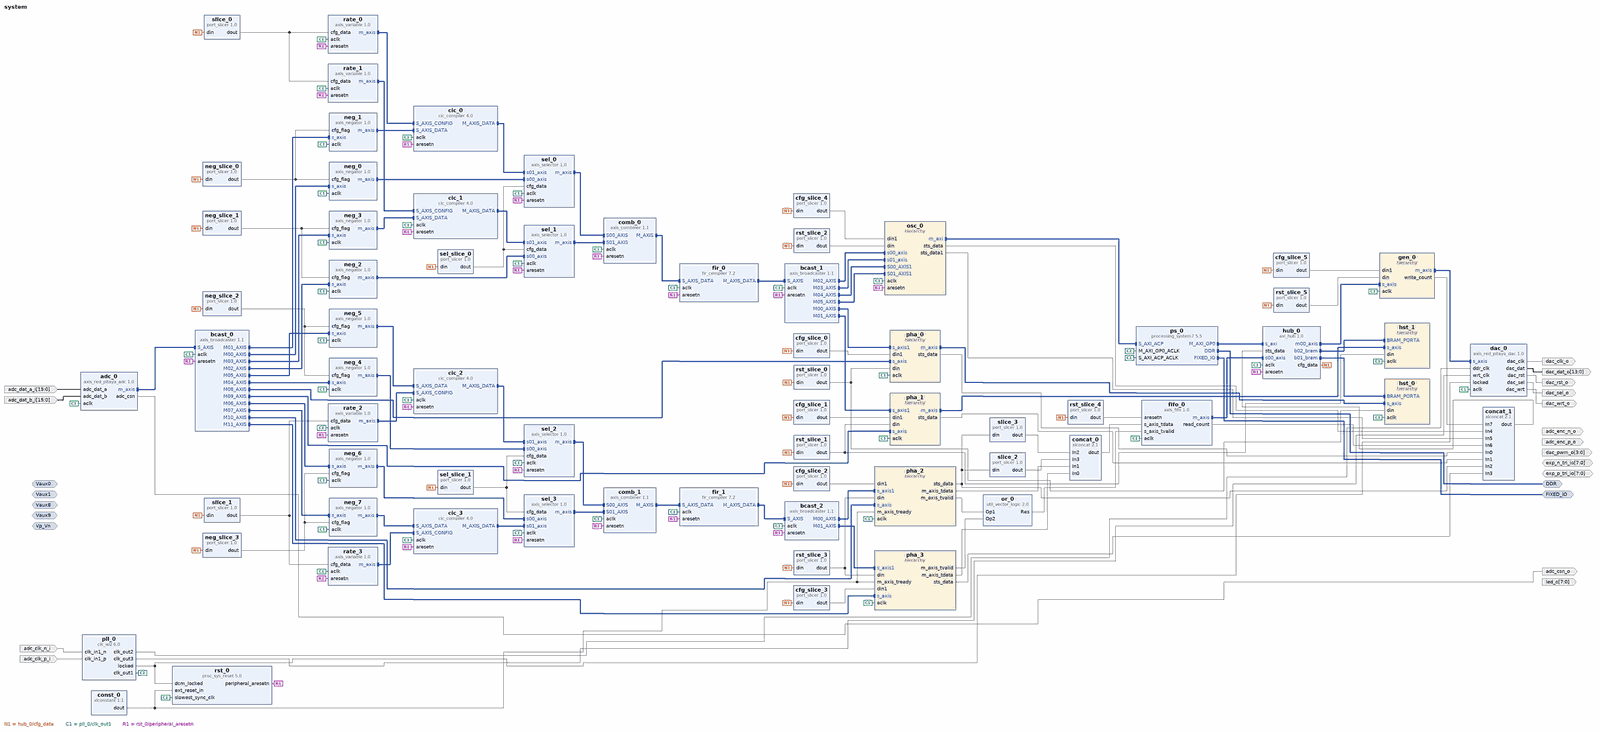
[diagram p0: block diagram of the top level, whole]
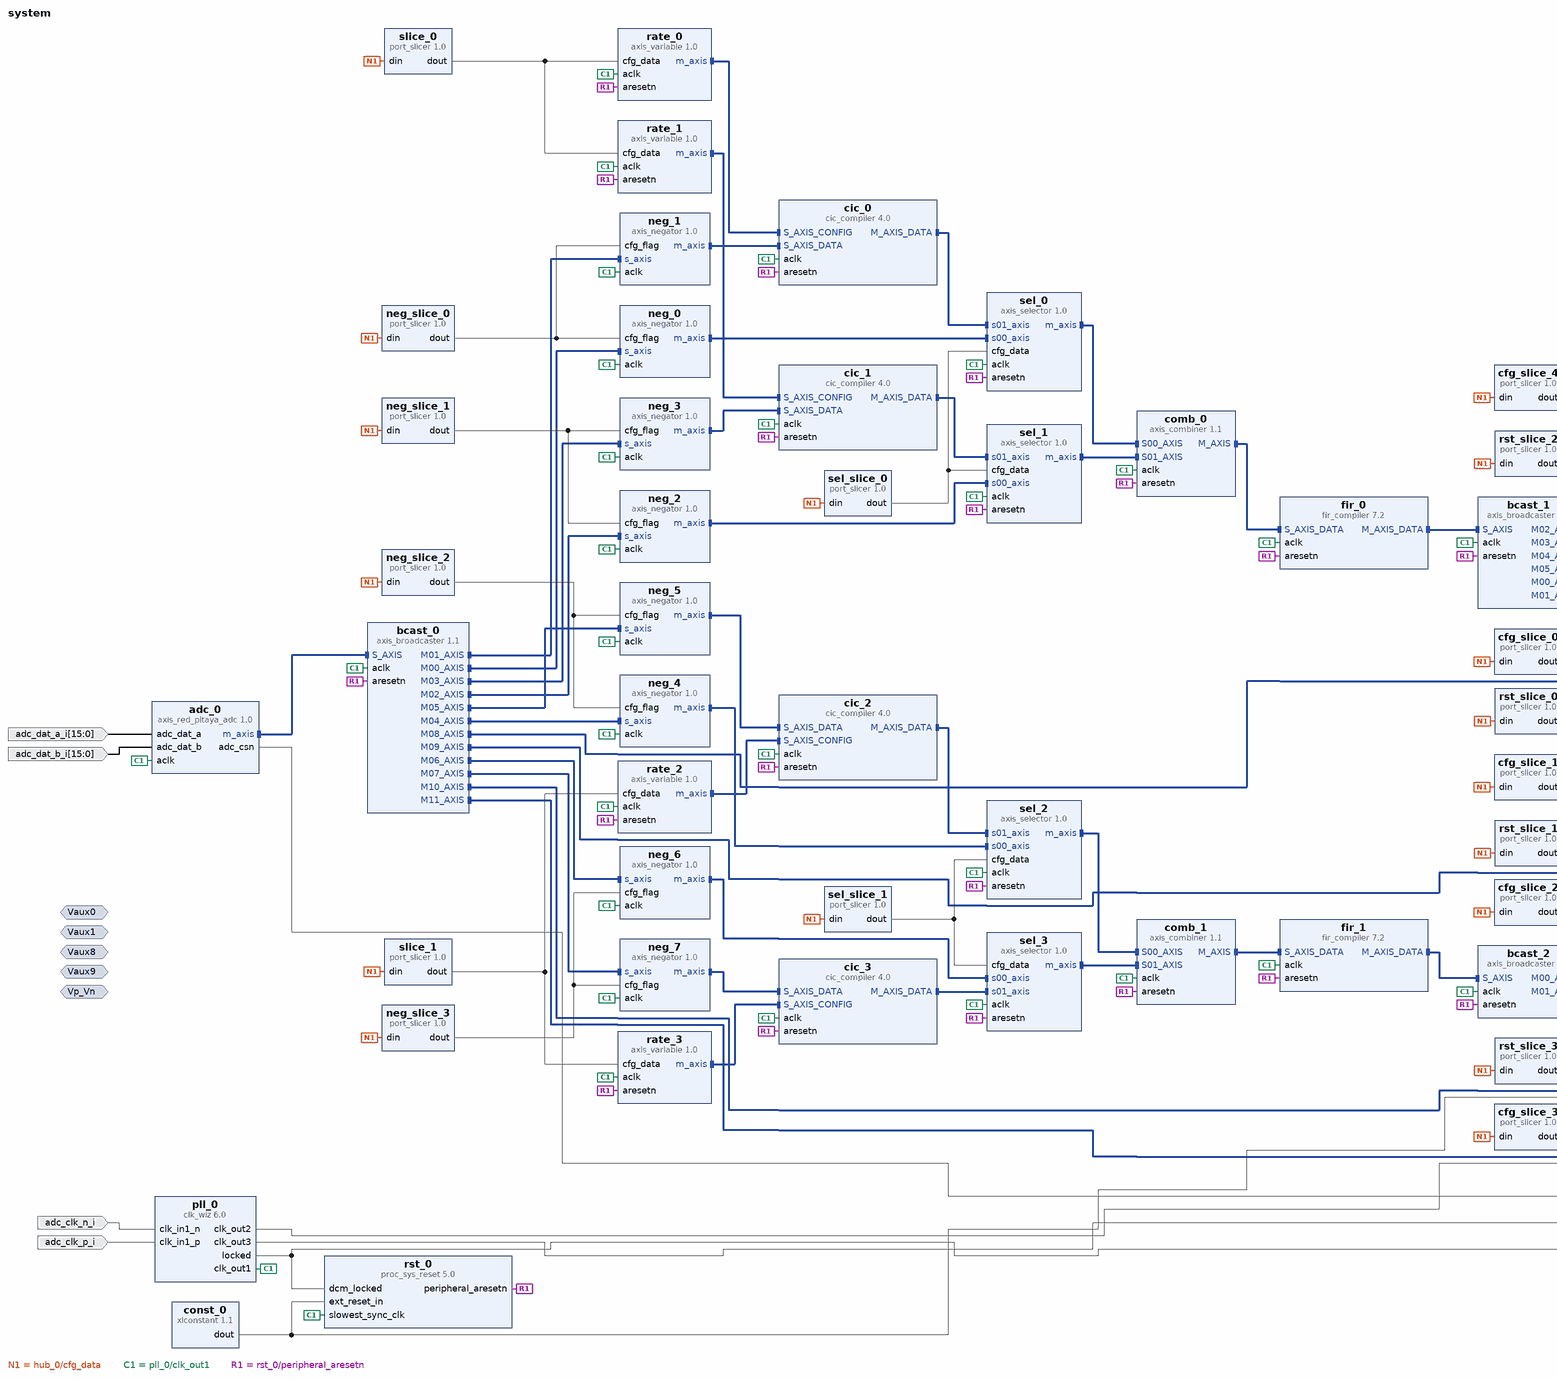
[diagram p1: block diagram of the top level, left part]
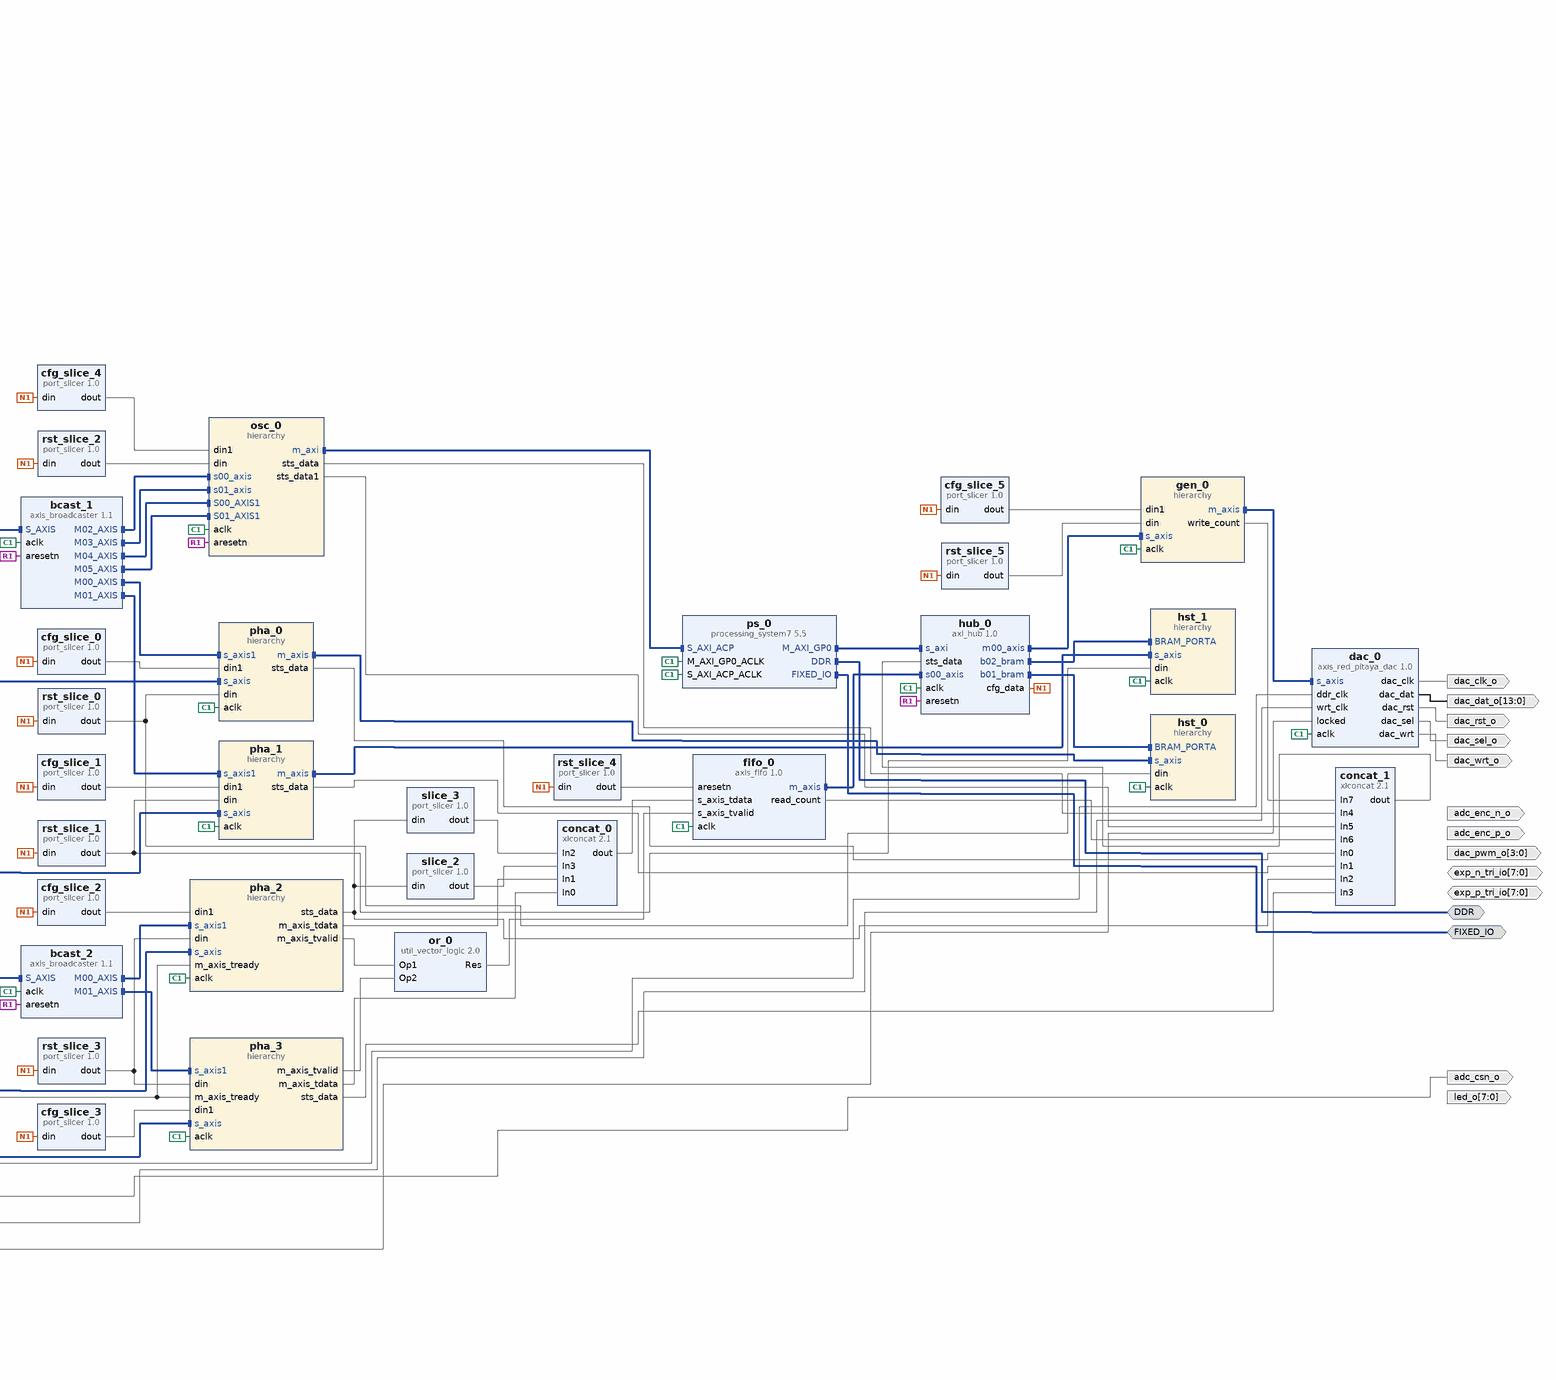
[diagram p2: block diagram of the top level, right part]
# Vivado block design system, xc7z010clg400-1, Vivado 2023.1
create_bd_design system

create_bd_intf_port -mode Slave -vlnv xilinx.com:interface:diff_analog_io_rtl:1.0 Vp_Vn
create_bd_intf_port -mode Slave -vlnv xilinx.com:interface:diff_analog_io_rtl:1.0 Vaux0
create_bd_intf_port -mode Slave -vlnv xilinx.com:interface:diff_analog_io_rtl:1.0 Vaux1
create_bd_intf_port -mode Slave -vlnv xilinx.com:interface:diff_analog_io_rtl:1.0 Vaux9
create_bd_intf_port -mode Slave -vlnv xilinx.com:interface:diff_analog_io_rtl:1.0 Vaux8
create_bd_intf_port -mode Master -vlnv xilinx.com:interface:ddrx_rtl:1.0 DDR
create_bd_intf_port -mode Master -vlnv xilinx.com:display_processing_system7:fixedio_rtl:1.0 FIXED_IO
create_bd_port -dir I -from 15 -to 0 adc_dat_a_i
create_bd_port -dir I -from 15 -to 0 adc_dat_b_i
create_bd_port -dir I adc_clk_p_i
create_bd_port -dir I adc_clk_n_i
create_bd_port -dir O adc_enc_p_o
create_bd_port -dir O adc_enc_n_o
create_bd_port -dir O adc_csn_o
create_bd_port -dir O -from 13 -to 0 dac_dat_o
create_bd_port -dir O dac_clk_o
create_bd_port -dir O dac_rst_o
create_bd_port -dir O dac_sel_o
create_bd_port -dir O dac_wrt_o
create_bd_port -dir O -from 3 -to 0 dac_pwm_o
create_bd_port -dir IO -from 7 -to 0 exp_p_tri_io
create_bd_port -dir IO -from 7 -to 0 exp_n_tri_io
create_bd_port -dir O -from 7 -to 0 led_o

create_bd_cell -type ip -vlnv xilinx.com:ip:clk_wiz:6.0 pll_0
set_property -dict [list \
  CONFIG.CLKOUT1_REQUESTED_OUT_FREQ 125.0 \
  CONFIG.CLKOUT1_USED true \
  CONFIG.CLKOUT2_REQUESTED_OUT_FREQ 250.0 \
  CONFIG.CLKOUT2_REQUESTED_PHASE 157.5 \
  CONFIG.CLKOUT2_USED true \
  CONFIG.CLKOUT3_REQUESTED_OUT_FREQ 250.0 \
  CONFIG.CLKOUT3_REQUESTED_PHASE 202.5 \
  CONFIG.CLKOUT3_USED true \
  CONFIG.PRIMITIVE PLL \
  CONFIG.PRIM_IN_FREQ 125.0 \
  CONFIG.PRIM_SOURCE Differential_clock_capable_pin \
  CONFIG.USE_RESET false \
] [get_bd_cells pll_0]
create_bd_cell -type ip -vlnv xilinx.com:ip:processing_system7:5.5 ps_0
set_property -dict [list \
  CONFIG.PCW_APU_PERIPHERAL_FREQMHZ 666.666666 \
  CONFIG.PCW_ENET0_ENET0_IO {MIO 16 .. 27} \
  CONFIG.PCW_ENET0_GRP_MDIO_ENABLE 1 \
  CONFIG.PCW_ENET0_GRP_MDIO_IO {MIO 52 .. 53} \
  CONFIG.PCW_ENET0_PERIPHERAL_ENABLE 1 \
  CONFIG.PCW_ENET0_RESET_ENABLE 0 \
  CONFIG.PCW_ENET_RESET_ENABLE 1 \
  CONFIG.PCW_ENET_RESET_SELECT {Share reset pin} \
  CONFIG.PCW_FPGA0_PERIPHERAL_FREQMHZ 50 \
  CONFIG.PCW_FPGA1_PERIPHERAL_FREQMHZ 50 \
  CONFIG.PCW_GPIO_EMIO_GPIO_ENABLE 1 \
  CONFIG.PCW_GPIO_EMIO_GPIO_IO 64 \
  CONFIG.PCW_GPIO_MIO_GPIO_ENABLE 1 \
  CONFIG.PCW_GPIO_MIO_GPIO_IO MIO \
  CONFIG.PCW_GPIO_PERIPHERAL_ENABLE 1 \
  CONFIG.PCW_I2C0_GRP_INT_ENABLE 0 \
  CONFIG.PCW_I2C0_I2C0_IO {MIO 50 .. 51} \
  CONFIG.PCW_I2C0_PERIPHERAL_ENABLE 1 \
  CONFIG.PCW_I2C_PERIPHERAL_FREQMHZ 111.111115 \
  CONFIG.PCW_I2C_RESET_ENABLE 1 \
  CONFIG.PCW_I2C_RESET_SELECT {Share reset pin} \
  CONFIG.PCW_IMPORT_BOARD_PRESET cfg/red_pitaya.xml \
  CONFIG.PCW_PRESET_BANK1_VOLTAGE {LVCMOS 2.5V} \
  CONFIG.PCW_QSPI_PERIPHERAL_ENABLE 0 \
  CONFIG.PCW_SD0_GRP_CD_ENABLE 1 \
  CONFIG.PCW_SD0_GRP_CD_IO {MIO 46} \
  CONFIG.PCW_SD0_GRP_WP_ENABLE 1 \
  CONFIG.PCW_SD0_GRP_WP_IO {MIO 47} \
  CONFIG.PCW_SD0_PERIPHERAL_ENABLE 1 \
  CONFIG.PCW_SD0_SD0_IO {MIO 40 .. 45} \
  CONFIG.PCW_SDIO_PERIPHERAL_FREQMHZ 100 \
  CONFIG.PCW_SPI0_PERIPHERAL_ENABLE 1 \
  CONFIG.PCW_SPI0_SPI0_IO EMIO \
  CONFIG.PCW_SPI1_PERIPHERAL_ENABLE 1 \
  CONFIG.PCW_SPI1_SPI1_IO {MIO 10 .. 15} \
  CONFIG.PCW_UART0_PERIPHERAL_ENABLE 1 \
  CONFIG.PCW_UART0_UART0_IO {MIO 14 .. 15} \
  CONFIG.PCW_UART1_PERIPHERAL_ENABLE 1 \
  CONFIG.PCW_UART1_UART1_IO {MIO 8 .. 9} \
  CONFIG.PCW_UART_PERIPHERAL_FREQMHZ 100 \
  CONFIG.PCW_UIPARAM_DDR_BUS_WIDTH {16 Bit} \
  CONFIG.PCW_UIPARAM_DDR_FREQ_MHZ 533.333333 \
  CONFIG.PCW_UIPARAM_DDR_PARTNO {MT41J256M16 RE-125} \
  CONFIG.PCW_USB0_PERIPHERAL_ENABLE 1 \
  CONFIG.PCW_USB0_RESET_ENABLE 1 \
  CONFIG.PCW_USB0_RESET_IO {MIO 48} \
  CONFIG.PCW_USB0_USB0_IO {MIO 28 .. 39} \
  CONFIG.PCW_USB_RESET_ENABLE 1 \
  CONFIG.PCW_USB_RESET_SELECT {Share reset pin} \
  CONFIG.PCW_USE_DEFAULT_ACP_USER_VAL 1 \
  CONFIG.PCW_USE_S_AXI_ACP 1 \
] [get_bd_cells ps_0]
# 429 more settings of ps_0 are not shown: defaults, MIO pin electricals, DDR timing, and values the tool derives
create_bd_cell -type ip -vlnv xilinx.com:ip:xlconstant:1.1 const_0
create_bd_cell -type ip -vlnv xilinx.com:ip:proc_sys_reset:5.0 rst_0
create_bd_cell -type ip -vlnv pavel-demin:user:axis_red_pitaya_adc:1.0 adc_0
set_property -dict {CONFIG.ADC_DATA_WIDTH 14} [get_bd_cells adc_0]
create_bd_cell -type ip -vlnv pavel-demin:user:axis_red_pitaya_dac:1.0 dac_0
set_property -dict {CONFIG.DAC_DATA_WIDTH 14} [get_bd_cells dac_0]
create_bd_cell -type ip -vlnv pavel-demin:user:axi_hub:1.0 hub_0
set_property -dict {CONFIG.CFG_DATA_WIDTH 800 CONFIG.STS_DATA_WIDTH 352} [get_bd_cells hub_0]
create_bd_cell -type ip -vlnv pavel-demin:user:port_slicer:1.0 rst_slice_0
set_property -dict {CONFIG.DIN_FROM 7 CONFIG.DIN_TO 0 CONFIG.DIN_WIDTH 800} [get_bd_cells rst_slice_0]
create_bd_cell -type ip -vlnv pavel-demin:user:port_slicer:1.0 sel_slice_0
set_property -dict {CONFIG.DIN_FROM 3 CONFIG.DIN_TO 3 CONFIG.DIN_WIDTH 800} [get_bd_cells sel_slice_0]
create_bd_cell -type ip -vlnv pavel-demin:user:port_slicer:1.0 neg_slice_0
set_property -dict {CONFIG.DIN_FROM 4 CONFIG.DIN_TO 4 CONFIG.DIN_WIDTH 800} [get_bd_cells neg_slice_0]
create_bd_cell -type ip -vlnv pavel-demin:user:port_slicer:1.0 rst_slice_1
set_property -dict {CONFIG.DIN_FROM 15 CONFIG.DIN_TO 8 CONFIG.DIN_WIDTH 800} [get_bd_cells rst_slice_1]
create_bd_cell -type ip -vlnv pavel-demin:user:port_slicer:1.0 neg_slice_1
set_property -dict {CONFIG.DIN_FROM 12 CONFIG.DIN_TO 12 CONFIG.DIN_WIDTH 800} [get_bd_cells neg_slice_1]
create_bd_cell -type ip -vlnv pavel-demin:user:port_slicer:1.0 rst_slice_2
set_property -dict {CONFIG.DIN_FROM 23 CONFIG.DIN_TO 16 CONFIG.DIN_WIDTH 800} [get_bd_cells rst_slice_2]
create_bd_cell -type ip -vlnv pavel-demin:user:port_slicer:1.0 rst_slice_3
set_property -dict {CONFIG.DIN_FROM 31 CONFIG.DIN_TO 24 CONFIG.DIN_WIDTH 800} [get_bd_cells rst_slice_3]
create_bd_cell -type ip -vlnv pavel-demin:user:port_slicer:1.0 sel_slice_1
set_property -dict {CONFIG.DIN_FROM 27 CONFIG.DIN_TO 27 CONFIG.DIN_WIDTH 800} [get_bd_cells sel_slice_1]
create_bd_cell -type ip -vlnv pavel-demin:user:port_slicer:1.0 neg_slice_2
set_property -dict {CONFIG.DIN_FROM 28 CONFIG.DIN_TO 28 CONFIG.DIN_WIDTH 800} [get_bd_cells neg_slice_2]
create_bd_cell -type ip -vlnv pavel-demin:user:port_slicer:1.0 neg_slice_3
set_property -dict {CONFIG.DIN_FROM 29 CONFIG.DIN_TO 29 CONFIG.DIN_WIDTH 800} [get_bd_cells neg_slice_3]
create_bd_cell -type ip -vlnv pavel-demin:user:port_slicer:1.0 rst_slice_4
set_property -dict {CONFIG.DIN_FROM 30 CONFIG.DIN_TO 30 CONFIG.DIN_WIDTH 800} [get_bd_cells rst_slice_4]
create_bd_cell -type ip -vlnv pavel-demin:user:port_slicer:1.0 rst_slice_5
set_property -dict {CONFIG.DIN_FROM 31 CONFIG.DIN_TO 31 CONFIG.DIN_WIDTH 800} [get_bd_cells rst_slice_5]
create_bd_cell -type ip -vlnv pavel-demin:user:port_slicer:1.0 slice_0
set_property -dict {CONFIG.DIN_FROM 47 CONFIG.DIN_TO 32 CONFIG.DIN_WIDTH 800} [get_bd_cells slice_0]
create_bd_cell -type ip -vlnv pavel-demin:user:port_slicer:1.0 slice_1
set_property -dict {CONFIG.DIN_FROM 63 CONFIG.DIN_TO 48 CONFIG.DIN_WIDTH 800} [get_bd_cells slice_1]
create_bd_cell -type ip -vlnv pavel-demin:user:port_slicer:1.0 cfg_slice_0
set_property -dict {CONFIG.DIN_FROM 191 CONFIG.DIN_TO 64 CONFIG.DIN_WIDTH 800} [get_bd_cells cfg_slice_0]
create_bd_cell -type ip -vlnv pavel-demin:user:port_slicer:1.0 cfg_slice_1
set_property -dict {CONFIG.DIN_FROM 319 CONFIG.DIN_TO 192 CONFIG.DIN_WIDTH 800} [get_bd_cells cfg_slice_1]
create_bd_cell -type ip -vlnv pavel-demin:user:port_slicer:1.0 cfg_slice_2
set_property -dict {CONFIG.DIN_FROM 447 CONFIG.DIN_TO 320 CONFIG.DIN_WIDTH 800} [get_bd_cells cfg_slice_2]
create_bd_cell -type ip -vlnv pavel-demin:user:port_slicer:1.0 cfg_slice_3
set_property -dict {CONFIG.DIN_FROM 575 CONFIG.DIN_TO 448 CONFIG.DIN_WIDTH 800} [get_bd_cells cfg_slice_3]
create_bd_cell -type ip -vlnv pavel-demin:user:port_slicer:1.0 cfg_slice_4
set_property -dict {CONFIG.DIN_FROM 703 CONFIG.DIN_TO 576 CONFIG.DIN_WIDTH 800} [get_bd_cells cfg_slice_4]
create_bd_cell -type ip -vlnv pavel-demin:user:port_slicer:1.0 cfg_slice_5
set_property -dict {CONFIG.DIN_FROM 799 CONFIG.DIN_TO 704 CONFIG.DIN_WIDTH 800} [get_bd_cells cfg_slice_5]
create_bd_cell -type ip -vlnv xilinx.com:ip:axis_broadcaster:1.1 bcast_0
set_property -dict [list \
  CONFIG.M00_TDATA_REMAP {tdata[15:0]} \
  CONFIG.M01_TDATA_REMAP {tdata[15:0]} \
  CONFIG.M02_TDATA_REMAP {tdata[31:16]} \
  CONFIG.M03_TDATA_REMAP {tdata[31:16]} \
  CONFIG.M04_TDATA_REMAP {tdata[15:0]} \
  CONFIG.M05_TDATA_REMAP {tdata[15:0]} \
  CONFIG.M06_TDATA_REMAP {tdata[31:16]} \
  CONFIG.M07_TDATA_REMAP {tdata[31:16]} \
  CONFIG.M08_TDATA_REMAP {16'b0000000000000000} \
  CONFIG.M09_TDATA_REMAP {16'b0000000000000000} \
  CONFIG.M10_TDATA_REMAP {16'b0000000000000000} \
  CONFIG.M11_TDATA_REMAP {16'b0000000000000000} \
  CONFIG.M_TDATA_NUM_BYTES 2 \
  CONFIG.NUM_MI 12 \
  CONFIG.S_TDATA_NUM_BYTES 4 \
] [get_bd_cells bcast_0]
create_bd_cell -type ip -vlnv pavel-demin:user:axis_negator:1.0 neg_0
set_property -dict {CONFIG.AXIS_TDATA_WIDTH 16} [get_bd_cells neg_0]
create_bd_cell -type ip -vlnv pavel-demin:user:axis_negator:1.0 neg_1
set_property -dict {CONFIG.AXIS_TDATA_WIDTH 16} [get_bd_cells neg_1]
create_bd_cell -type ip -vlnv pavel-demin:user:axis_negator:1.0 neg_2
set_property -dict {CONFIG.AXIS_TDATA_WIDTH 16} [get_bd_cells neg_2]
create_bd_cell -type ip -vlnv pavel-demin:user:axis_negator:1.0 neg_3
set_property -dict {CONFIG.AXIS_TDATA_WIDTH 16} [get_bd_cells neg_3]
create_bd_cell -type ip -vlnv pavel-demin:user:axis_negator:1.0 neg_4
set_property -dict {CONFIG.AXIS_TDATA_WIDTH 16} [get_bd_cells neg_4]
create_bd_cell -type ip -vlnv pavel-demin:user:axis_negator:1.0 neg_5
set_property -dict {CONFIG.AXIS_TDATA_WIDTH 16} [get_bd_cells neg_5]
create_bd_cell -type ip -vlnv pavel-demin:user:axis_negator:1.0 neg_6
set_property -dict {CONFIG.AXIS_TDATA_WIDTH 16} [get_bd_cells neg_6]
create_bd_cell -type ip -vlnv pavel-demin:user:axis_negator:1.0 neg_7
set_property -dict {CONFIG.AXIS_TDATA_WIDTH 16} [get_bd_cells neg_7]
create_bd_cell -type ip -vlnv pavel-demin:user:axis_variable:1.0 rate_0
set_property -dict {CONFIG.AXIS_TDATA_WIDTH 16} [get_bd_cells rate_0]
create_bd_cell -type ip -vlnv xilinx.com:ip:cic_compiler:4.0 cic_0
set_property -dict [list \
  CONFIG.Clock_Frequency 125 \
  CONFIG.Filter_Type Decimation \
  CONFIG.Fixed_Or_Initial_Rate 4 \
  CONFIG.HAS_ARESETN true \
  CONFIG.Input_Data_Width 14 \
  CONFIG.Input_Sample_Frequency 125 \
  CONFIG.Maximum_Rate 8192 \
  CONFIG.Minimum_Rate 4 \
  CONFIG.Number_Of_Stages 6 \
  CONFIG.Output_Data_Width 14 \
  CONFIG.Quantization Truncation \
  CONFIG.Sample_Rate_Changes Programmable \
  CONFIG.Use_Xtreme_DSP_Slice false \
] [get_bd_cells cic_0]
create_bd_cell -type ip -vlnv pavel-demin:user:axis_selector:1.0 sel_0
set_property -dict {CONFIG.AXIS_TDATA_WIDTH 16} [get_bd_cells sel_0]
create_bd_cell -type ip -vlnv pavel-demin:user:axis_variable:1.0 rate_1
set_property -dict {CONFIG.AXIS_TDATA_WIDTH 16} [get_bd_cells rate_1]
create_bd_cell -type ip -vlnv xilinx.com:ip:cic_compiler:4.0 cic_1
set_property -dict [list \
  CONFIG.Clock_Frequency 125 \
  CONFIG.Filter_Type Decimation \
  CONFIG.Fixed_Or_Initial_Rate 4 \
  CONFIG.HAS_ARESETN true \
  CONFIG.Input_Data_Width 14 \
  CONFIG.Input_Sample_Frequency 125 \
  CONFIG.Maximum_Rate 8192 \
  CONFIG.Minimum_Rate 4 \
  CONFIG.Number_Of_Stages 6 \
  CONFIG.Output_Data_Width 14 \
  CONFIG.Quantization Truncation \
  CONFIG.Sample_Rate_Changes Programmable \
  CONFIG.Use_Xtreme_DSP_Slice false \
] [get_bd_cells cic_1]
create_bd_cell -type ip -vlnv pavel-demin:user:axis_selector:1.0 sel_1
set_property -dict {CONFIG.AXIS_TDATA_WIDTH 16} [get_bd_cells sel_1]
create_bd_cell -type ip -vlnv pavel-demin:user:axis_variable:1.0 rate_2
set_property -dict {CONFIG.AXIS_TDATA_WIDTH 16} [get_bd_cells rate_2]
create_bd_cell -type ip -vlnv xilinx.com:ip:cic_compiler:4.0 cic_2
set_property -dict [list \
  CONFIG.Clock_Frequency 125 \
  CONFIG.Filter_Type Decimation \
  CONFIG.Fixed_Or_Initial_Rate 4 \
  CONFIG.HAS_ARESETN true \
  CONFIG.Input_Data_Width 14 \
  CONFIG.Input_Sample_Frequency 125 \
  CONFIG.Maximum_Rate 8192 \
  CONFIG.Minimum_Rate 4 \
  CONFIG.Number_Of_Stages 6 \
  CONFIG.Output_Data_Width 14 \
  CONFIG.Quantization Truncation \
  CONFIG.Sample_Rate_Changes Programmable \
  CONFIG.Use_Xtreme_DSP_Slice false \
] [get_bd_cells cic_2]
create_bd_cell -type ip -vlnv pavel-demin:user:axis_selector:1.0 sel_2
set_property -dict {CONFIG.AXIS_TDATA_WIDTH 16} [get_bd_cells sel_2]
create_bd_cell -type ip -vlnv pavel-demin:user:axis_variable:1.0 rate_3
set_property -dict {CONFIG.AXIS_TDATA_WIDTH 16} [get_bd_cells rate_3]
create_bd_cell -type ip -vlnv xilinx.com:ip:cic_compiler:4.0 cic_3
set_property -dict [list \
  CONFIG.Clock_Frequency 125 \
  CONFIG.Filter_Type Decimation \
  CONFIG.Fixed_Or_Initial_Rate 4 \
  CONFIG.HAS_ARESETN true \
  CONFIG.Input_Data_Width 14 \
  CONFIG.Input_Sample_Frequency 125 \
  CONFIG.Maximum_Rate 8192 \
  CONFIG.Minimum_Rate 4 \
  CONFIG.Number_Of_Stages 6 \
  CONFIG.Output_Data_Width 14 \
  CONFIG.Quantization Truncation \
  CONFIG.Sample_Rate_Changes Programmable \
  CONFIG.Use_Xtreme_DSP_Slice false \
] [get_bd_cells cic_3]
create_bd_cell -type ip -vlnv pavel-demin:user:axis_selector:1.0 sel_3
set_property -dict {CONFIG.AXIS_TDATA_WIDTH 16} [get_bd_cells sel_3]
create_bd_cell -type ip -vlnv xilinx.com:ip:axis_combiner:1.1 comb_0
set_property -dict {CONFIG.TDATA_NUM_BYTES 2} [get_bd_cells comb_0]
create_bd_cell -type ip -vlnv xilinx.com:ip:fir_compiler:7.2 fir_0
set_property -dict [list \
  CONFIG.BestPrecision true \
  CONFIG.Clock_Frequency 125 \
  CONFIG.CoefficientVector {['5.2264535203e-06, 5.7185303335e-05, 2.6647653637e-04, 7.9231931667e-04, 1.8933556984e-03, 3.9077032410e-03, 7.2107962593e-03, 1.2147384825e-02, 1.8943280784e-02, 2.7612738319e-02, 3.7884778843e-02,', '4.9172940009e-02, 6.0606317648e-02, 7.1126384126e-02, 7.9637295055e-02, 8.5182038247e-02, 8.7107558671e-02, 8.5182038247e-02, 7.9637295055e-02, 7.1126384126e-02, 6.0606317648e-02, 4.9172940009e-02,', '3.7884778843e-02, 2.7612738319e-02, 1.8943280784e-02, 1.2147384825e-02, 7.2107962593e-03, 3.9077032410e-03, 1.8933556984e-03, 7.9231931667e-04, 2.6647653637e-04, 5.7185303335e-05, 5.2264535203e-06']} \
  CONFIG.Coefficient_Width 16 \
  CONFIG.Data_Width 14 \
  CONFIG.Has_ARESETn true \
  CONFIG.Number_Paths 2 \
  CONFIG.Output_Rounding_Mode Non_Symmetric_Rounding_Up \
  CONFIG.Output_Width 14 \
  CONFIG.Quantization Quantize_Only \
  CONFIG.Sample_Frequency 125 \
] [get_bd_cells fir_0]
create_bd_cell -type ip -vlnv xilinx.com:ip:axis_combiner:1.1 comb_1
set_property -dict {CONFIG.TDATA_NUM_BYTES 2} [get_bd_cells comb_1]
create_bd_cell -type ip -vlnv xilinx.com:ip:fir_compiler:7.2 fir_1
set_property -dict [list \
  CONFIG.BestPrecision true \
  CONFIG.Clock_Frequency 125 \
  CONFIG.CoefficientVector {['5.2264535203e-06, 5.7185303335e-05, 2.6647653637e-04, 7.9231931667e-04, 1.8933556984e-03, 3.9077032410e-03, 7.2107962593e-03, 1.2147384825e-02, 1.8943280784e-02, 2.7612738319e-02, 3.7884778843e-02,', '4.9172940009e-02, 6.0606317648e-02, 7.1126384126e-02, 7.9637295055e-02, 8.5182038247e-02, 8.7107558671e-02, 8.5182038247e-02, 7.9637295055e-02, 7.1126384126e-02, 6.0606317648e-02, 4.9172940009e-02,', '3.7884778843e-02, 2.7612738319e-02, 1.8943280784e-02, 1.2147384825e-02, 7.2107962593e-03, 3.9077032410e-03, 1.8933556984e-03, 7.9231931667e-04, 2.6647653637e-04, 5.7185303335e-05, 5.2264535203e-06']} \
  CONFIG.Coefficient_Width 16 \
  CONFIG.Data_Width 14 \
  CONFIG.Has_ARESETn true \
  CONFIG.Number_Paths 2 \
  CONFIG.Output_Rounding_Mode Non_Symmetric_Rounding_Up \
  CONFIG.Output_Width 14 \
  CONFIG.Quantization Quantize_Only \
  CONFIG.Sample_Frequency 125 \
] [get_bd_cells fir_1]
create_bd_cell -type ip -vlnv xilinx.com:ip:axis_broadcaster:1.1 bcast_1
set_property -dict [list \
  CONFIG.M00_TDATA_REMAP {tdata[15:0]} \
  CONFIG.M01_TDATA_REMAP {tdata[31:16]} \
  CONFIG.M02_TDATA_REMAP {tdata[15:0]} \
  CONFIG.M03_TDATA_REMAP {tdata[31:16]} \
  CONFIG.M04_TDATA_REMAP {tdata[15:0]} \
  CONFIG.M05_TDATA_REMAP {tdata[31:16]} \
  CONFIG.M_TDATA_NUM_BYTES 2 \
  CONFIG.NUM_MI 6 \
  CONFIG.S_TDATA_NUM_BYTES 4 \
] [get_bd_cells bcast_1]
create_bd_cell -type ip -vlnv xilinx.com:ip:axis_broadcaster:1.1 bcast_2
set_property -dict [list \
  CONFIG.M00_TDATA_REMAP {tdata[15:0]} \
  CONFIG.M01_TDATA_REMAP {tdata[31:16]} \
  CONFIG.M_TDATA_NUM_BYTES 2 \
  CONFIG.S_TDATA_NUM_BYTES 4 \
] [get_bd_cells bcast_2]
create_bd_cell -type hier pha_0
create_bd_cell -type hier hst_0
create_bd_cell -type hier pha_1
create_bd_cell -type hier hst_1
create_bd_cell -type hier osc_0
create_bd_cell -type hier pha_2
create_bd_cell -type hier pha_3
create_bd_cell -type ip -vlnv pavel-demin:user:port_slicer:1.0 slice_2
set_property -dict {CONFIG.DIN_FROM 31 CONFIG.DIN_TO 0 CONFIG.DIN_WIDTH 64} [get_bd_cells slice_2]
create_bd_cell -type ip -vlnv pavel-demin:user:port_slicer:1.0 slice_3
set_property -dict {CONFIG.DIN_FROM 63 CONFIG.DIN_TO 32 CONFIG.DIN_WIDTH 64} [get_bd_cells slice_3]
create_bd_cell -type ip -vlnv xilinx.com:ip:xlconcat:2.1 concat_0
set_property -dict [list \
  CONFIG.IN0_WIDTH 32 \
  CONFIG.IN1_WIDTH 32 \
  CONFIG.IN2_WIDTH 32 \
  CONFIG.IN3_WIDTH 32 \
  CONFIG.NUM_PORTS 4 \
] [get_bd_cells concat_0]
create_bd_cell -type ip -vlnv xilinx.com:ip:util_vector_logic:2.0 or_0
set_property -dict {CONFIG.C_OPERATION or CONFIG.C_SIZE 1} [get_bd_cells or_0]
create_bd_cell -type ip -vlnv pavel-demin:user:axis_fifo:1.0 fifo_0
set_property -dict {CONFIG.M_AXIS_TDATA_WIDTH 32 CONFIG.S_AXIS_TDATA_WIDTH 128 CONFIG.WRITE_DEPTH 2048} [get_bd_cells fifo_0]
create_bd_cell -type hier gen_0
create_bd_cell -type ip -vlnv xilinx.com:ip:xlconcat:2.1 concat_1
set_property -dict [list \
  CONFIG.IN0_WIDTH 64 \
  CONFIG.IN1_WIDTH 64 \
  CONFIG.IN2_WIDTH 64 \
  CONFIG.IN3_WIDTH 64 \
  CONFIG.IN4_WIDTH 32 \
  CONFIG.IN5_WIDTH 32 \
  CONFIG.IN6_WIDTH 16 \
  CONFIG.IN7_WIDTH 16 \
  CONFIG.NUM_PORTS 8 \
] [get_bd_cells concat_1]

# ---- hierarchy /pha_0 ----
current_bd_instance /pha_0
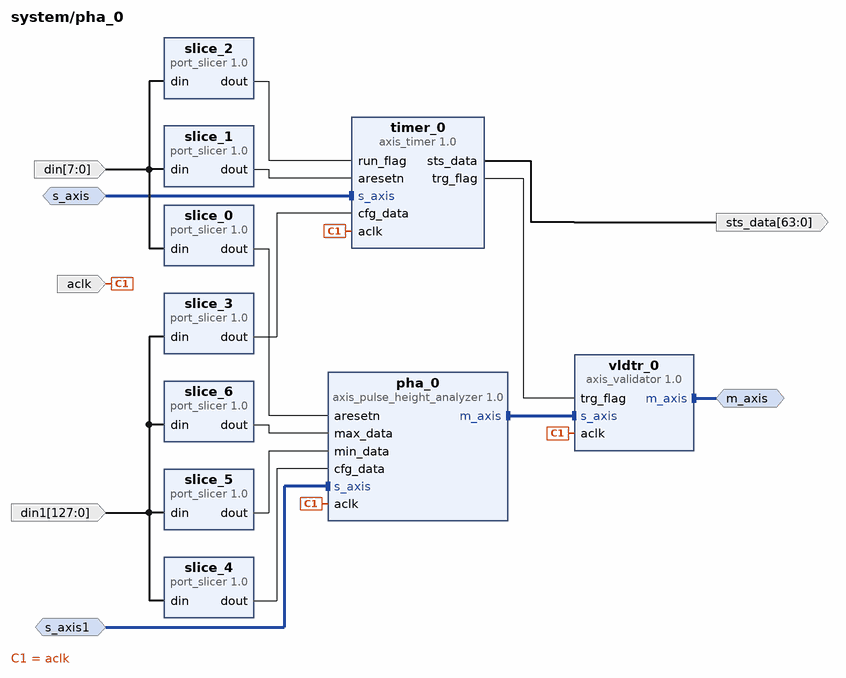
[diagram p3: block diagram inside /pha_0]
create_bd_intf_pin -mode Slave -vlnv xilinx.com:interface:axis_rtl:1.0 s_axis
create_bd_intf_pin -mode Slave -vlnv xilinx.com:interface:axis_rtl:1.0 s_axis1
create_bd_intf_pin -mode Master -vlnv xilinx.com:interface:axis_rtl:1.0 m_axis
create_bd_pin -dir I -type clk aclk
create_bd_pin -dir I -from 7 -to 0 din
create_bd_pin -dir I -from 127 -to 0 din1
create_bd_pin -dir O -from 63 -to 0 sts_data

create_bd_cell -type ip -vlnv pavel-demin:user:port_slicer:1.0 slice_0
set_property -dict {CONFIG.DIN_FROM 0 CONFIG.DIN_TO 0 CONFIG.DIN_WIDTH 8} [get_bd_cells slice_0]
create_bd_cell -type ip -vlnv pavel-demin:user:port_slicer:1.0 slice_1
set_property -dict {CONFIG.DIN_FROM 1 CONFIG.DIN_TO 1 CONFIG.DIN_WIDTH 8} [get_bd_cells slice_1]
create_bd_cell -type ip -vlnv pavel-demin:user:port_slicer:1.0 slice_2
set_property -dict {CONFIG.DIN_FROM 2 CONFIG.DIN_TO 2 CONFIG.DIN_WIDTH 8} [get_bd_cells slice_2]
create_bd_cell -type ip -vlnv pavel-demin:user:port_slicer:1.0 slice_3
set_property -dict {CONFIG.DIN_FROM 63 CONFIG.DIN_TO 0 CONFIG.DIN_WIDTH 128} [get_bd_cells slice_3]
create_bd_cell -type ip -vlnv pavel-demin:user:port_slicer:1.0 slice_4
set_property -dict {CONFIG.DIN_FROM 79 CONFIG.DIN_TO 64 CONFIG.DIN_WIDTH 128} [get_bd_cells slice_4]
create_bd_cell -type ip -vlnv pavel-demin:user:port_slicer:1.0 slice_5
set_property -dict {CONFIG.DIN_FROM 95 CONFIG.DIN_TO 80 CONFIG.DIN_WIDTH 128} [get_bd_cells slice_5]
create_bd_cell -type ip -vlnv pavel-demin:user:port_slicer:1.0 slice_6
set_property -dict {CONFIG.DIN_FROM 111 CONFIG.DIN_TO 96 CONFIG.DIN_WIDTH 128} [get_bd_cells slice_6]
create_bd_cell -type ip -vlnv pavel-demin:user:axis_timer:1.0 timer_0
set_property -dict {CONFIG.CNTR_WIDTH 64} [get_bd_cells timer_0]
create_bd_cell -type ip -vlnv pavel-demin:user:axis_pulse_height_analyzer:1.0 pha_0
set_property -dict {CONFIG.AXIS_TDATA_SIGNED TRUE CONFIG.AXIS_TDATA_WIDTH 16 CONFIG.CNTR_WIDTH 16} [get_bd_cells pha_0]
create_bd_cell -type ip -vlnv pavel-demin:user:axis_validator:1.0 vldtr_0
set_property -dict {CONFIG.AXIS_TDATA_WIDTH 16} [get_bd_cells vldtr_0]

# ---- hierarchy /hst_0 ----
current_bd_instance /hst_0
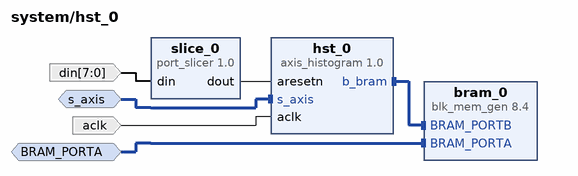
[diagram p4: block diagram inside /hst_0]
create_bd_intf_pin -mode Slave -vlnv xilinx.com:interface:axis_rtl:1.0 s_axis
create_bd_intf_pin -mode Slave -vlnv xilinx.com:interface:bram_rtl:1.0 BRAM_PORTA
create_bd_pin -dir I -type clk aclk
create_bd_pin -dir I -from 7 -to 0 din

create_bd_cell -type ip -vlnv pavel-demin:user:port_slicer:1.0 slice_0
set_property -dict {CONFIG.DIN_FROM 0 CONFIG.DIN_TO 0 CONFIG.DIN_WIDTH 8} [get_bd_cells slice_0]
create_bd_cell -type ip -vlnv xilinx.com:ip:blk_mem_gen:8.4 bram_0
set_property -dict [list \
  CONFIG.Byte_Size 8 \
  CONFIG.Memory_Type True_Dual_Port_RAM \
  CONFIG.Register_PortA_Output_of_Memory_Primitives false \
  CONFIG.Register_PortB_Output_of_Memory_Primitives false \
  CONFIG.Use_Byte_Write_Enable true \
  CONFIG.Write_Depth_A 4096 \
  CONFIG.Write_Width_A 32 \
  CONFIG.use_bram_block Stand_Alone \
] [get_bd_cells bram_0]
create_bd_cell -type ip -vlnv pavel-demin:user:axis_histogram:1.0 hst_0
set_property -dict {CONFIG.AXIS_TDATA_WIDTH 16 CONFIG.BRAM_ADDR_WIDTH 12 CONFIG.BRAM_DATA_WIDTH 32} [get_bd_cells hst_0]

# ---- hierarchy /pha_1 ----
current_bd_instance /pha_1
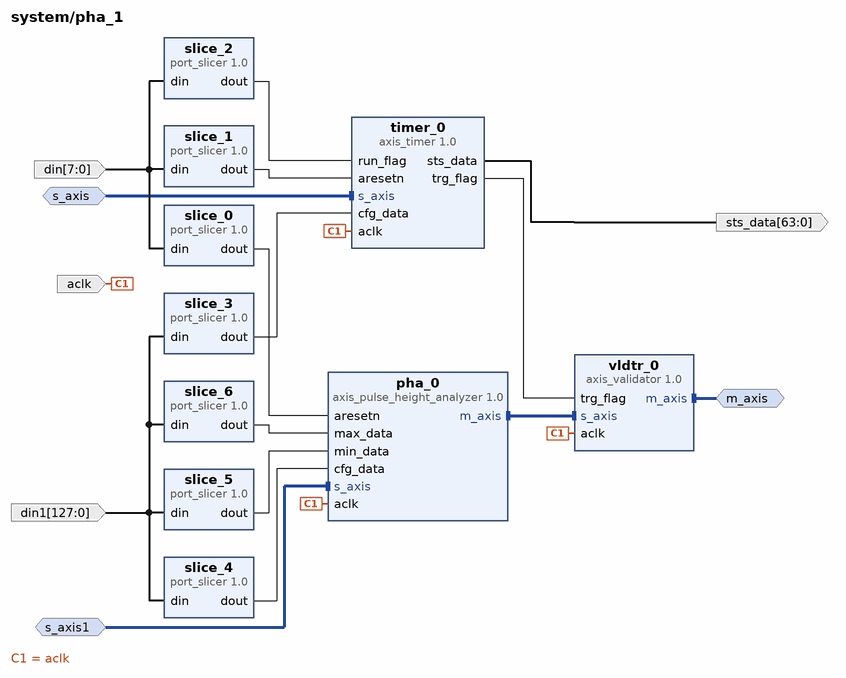
[diagram p5: block diagram inside /pha_1]
create_bd_intf_pin -mode Slave -vlnv xilinx.com:interface:axis_rtl:1.0 s_axis
create_bd_intf_pin -mode Slave -vlnv xilinx.com:interface:axis_rtl:1.0 s_axis1
create_bd_intf_pin -mode Master -vlnv xilinx.com:interface:axis_rtl:1.0 m_axis
create_bd_pin -dir I -type clk aclk
create_bd_pin -dir I -from 7 -to 0 din
create_bd_pin -dir I -from 127 -to 0 din1
create_bd_pin -dir O -from 63 -to 0 sts_data

create_bd_cell -type ip -vlnv pavel-demin:user:port_slicer:1.0 slice_0
set_property -dict {CONFIG.DIN_FROM 0 CONFIG.DIN_TO 0 CONFIG.DIN_WIDTH 8} [get_bd_cells slice_0]
create_bd_cell -type ip -vlnv pavel-demin:user:port_slicer:1.0 slice_1
set_property -dict {CONFIG.DIN_FROM 1 CONFIG.DIN_TO 1 CONFIG.DIN_WIDTH 8} [get_bd_cells slice_1]
create_bd_cell -type ip -vlnv pavel-demin:user:port_slicer:1.0 slice_2
set_property -dict {CONFIG.DIN_FROM 2 CONFIG.DIN_TO 2 CONFIG.DIN_WIDTH 8} [get_bd_cells slice_2]
create_bd_cell -type ip -vlnv pavel-demin:user:port_slicer:1.0 slice_3
set_property -dict {CONFIG.DIN_FROM 63 CONFIG.DIN_TO 0 CONFIG.DIN_WIDTH 128} [get_bd_cells slice_3]
create_bd_cell -type ip -vlnv pavel-demin:user:port_slicer:1.0 slice_4
set_property -dict {CONFIG.DIN_FROM 79 CONFIG.DIN_TO 64 CONFIG.DIN_WIDTH 128} [get_bd_cells slice_4]
create_bd_cell -type ip -vlnv pavel-demin:user:port_slicer:1.0 slice_5
set_property -dict {CONFIG.DIN_FROM 95 CONFIG.DIN_TO 80 CONFIG.DIN_WIDTH 128} [get_bd_cells slice_5]
create_bd_cell -type ip -vlnv pavel-demin:user:port_slicer:1.0 slice_6
set_property -dict {CONFIG.DIN_FROM 111 CONFIG.DIN_TO 96 CONFIG.DIN_WIDTH 128} [get_bd_cells slice_6]
create_bd_cell -type ip -vlnv pavel-demin:user:axis_timer:1.0 timer_0
set_property -dict {CONFIG.CNTR_WIDTH 64} [get_bd_cells timer_0]
create_bd_cell -type ip -vlnv pavel-demin:user:axis_pulse_height_analyzer:1.0 pha_0
set_property -dict {CONFIG.AXIS_TDATA_SIGNED TRUE CONFIG.AXIS_TDATA_WIDTH 16 CONFIG.CNTR_WIDTH 16} [get_bd_cells pha_0]
create_bd_cell -type ip -vlnv pavel-demin:user:axis_validator:1.0 vldtr_0
set_property -dict {CONFIG.AXIS_TDATA_WIDTH 16} [get_bd_cells vldtr_0]

# ---- hierarchy /hst_1 ----
current_bd_instance /hst_1
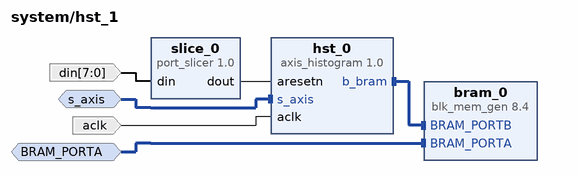
[diagram p6: block diagram inside /hst_1]
create_bd_intf_pin -mode Slave -vlnv xilinx.com:interface:axis_rtl:1.0 s_axis
create_bd_intf_pin -mode Slave -vlnv xilinx.com:interface:bram_rtl:1.0 BRAM_PORTA
create_bd_pin -dir I -type clk aclk
create_bd_pin -dir I -from 7 -to 0 din

create_bd_cell -type ip -vlnv pavel-demin:user:port_slicer:1.0 slice_0
set_property -dict {CONFIG.DIN_FROM 0 CONFIG.DIN_TO 0 CONFIG.DIN_WIDTH 8} [get_bd_cells slice_0]
create_bd_cell -type ip -vlnv xilinx.com:ip:blk_mem_gen:8.4 bram_0
set_property -dict [list \
  CONFIG.Byte_Size 8 \
  CONFIG.Memory_Type True_Dual_Port_RAM \
  CONFIG.Register_PortA_Output_of_Memory_Primitives false \
  CONFIG.Register_PortB_Output_of_Memory_Primitives false \
  CONFIG.Use_Byte_Write_Enable true \
  CONFIG.Write_Depth_A 4096 \
  CONFIG.Write_Width_A 32 \
  CONFIG.use_bram_block Stand_Alone \
] [get_bd_cells bram_0]
create_bd_cell -type ip -vlnv pavel-demin:user:axis_histogram:1.0 hst_0
set_property -dict {CONFIG.AXIS_TDATA_WIDTH 16 CONFIG.BRAM_ADDR_WIDTH 12 CONFIG.BRAM_DATA_WIDTH 32} [get_bd_cells hst_0]

# ---- hierarchy /osc_0 ----
current_bd_instance /osc_0
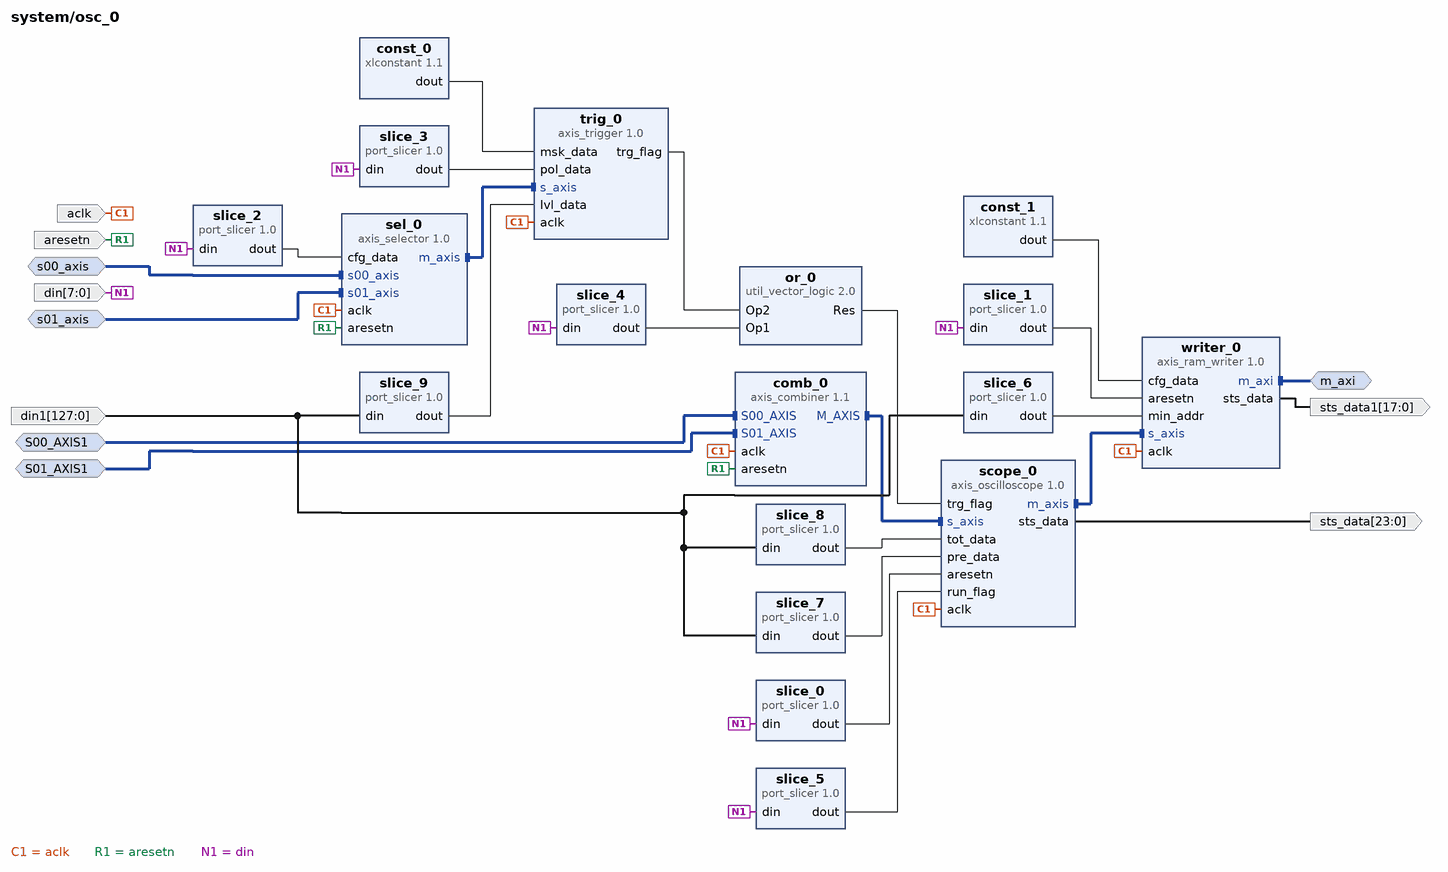
[diagram p7: block diagram inside /osc_0]
create_bd_intf_pin -mode Slave -vlnv xilinx.com:interface:axis_rtl:1.0 s00_axis
create_bd_intf_pin -mode Slave -vlnv xilinx.com:interface:axis_rtl:1.0 s01_axis
create_bd_intf_pin -mode Slave -vlnv xilinx.com:interface:axis_rtl:1.0 S00_AXIS1
create_bd_intf_pin -mode Slave -vlnv xilinx.com:interface:axis_rtl:1.0 S01_AXIS1
create_bd_intf_pin -mode Master -vlnv xilinx.com:interface:aximm_rtl:1.0 m_axi
create_bd_pin -dir I -type clk aclk
create_bd_pin -dir I -type rst aresetn
create_bd_pin -dir I -from 7 -to 0 din
create_bd_pin -dir I -from 127 -to 0 din1
create_bd_pin -dir O -from 23 -to 0 sts_data
create_bd_pin -dir O -from 17 -to 0 sts_data1

create_bd_cell -type ip -vlnv pavel-demin:user:port_slicer:1.0 slice_0
set_property -dict {CONFIG.DIN_FROM 0 CONFIG.DIN_TO 0 CONFIG.DIN_WIDTH 8} [get_bd_cells slice_0]
create_bd_cell -type ip -vlnv pavel-demin:user:port_slicer:1.0 slice_1
set_property -dict {CONFIG.DIN_FROM 1 CONFIG.DIN_TO 1 CONFIG.DIN_WIDTH 8} [get_bd_cells slice_1]
create_bd_cell -type ip -vlnv pavel-demin:user:port_slicer:1.0 slice_2
set_property -dict {CONFIG.DIN_FROM 2 CONFIG.DIN_TO 2 CONFIG.DIN_WIDTH 8} [get_bd_cells slice_2]
create_bd_cell -type ip -vlnv pavel-demin:user:port_slicer:1.0 slice_3
set_property -dict {CONFIG.DIN_FROM 3 CONFIG.DIN_TO 3 CONFIG.DIN_WIDTH 8} [get_bd_cells slice_3]
create_bd_cell -type ip -vlnv pavel-demin:user:port_slicer:1.0 slice_4
set_property -dict {CONFIG.DIN_FROM 4 CONFIG.DIN_TO 4 CONFIG.DIN_WIDTH 8} [get_bd_cells slice_4]
create_bd_cell -type ip -vlnv pavel-demin:user:port_slicer:1.0 slice_5
set_property -dict {CONFIG.DIN_FROM 5 CONFIG.DIN_TO 5 CONFIG.DIN_WIDTH 8} [get_bd_cells slice_5]
create_bd_cell -type ip -vlnv pavel-demin:user:port_slicer:1.0 slice_6
set_property -dict {CONFIG.DIN_FROM 31 CONFIG.DIN_TO 0 CONFIG.DIN_WIDTH 128} [get_bd_cells slice_6]
create_bd_cell -type ip -vlnv pavel-demin:user:port_slicer:1.0 slice_7
set_property -dict {CONFIG.DIN_FROM 63 CONFIG.DIN_TO 32 CONFIG.DIN_WIDTH 128} [get_bd_cells slice_7]
create_bd_cell -type ip -vlnv pavel-demin:user:port_slicer:1.0 slice_8
set_property -dict {CONFIG.DIN_FROM 95 CONFIG.DIN_TO 64 CONFIG.DIN_WIDTH 128} [get_bd_cells slice_8]
create_bd_cell -type ip -vlnv pavel-demin:user:port_slicer:1.0 slice_9
set_property -dict {CONFIG.DIN_FROM 111 CONFIG.DIN_TO 96 CONFIG.DIN_WIDTH 128} [get_bd_cells slice_9]
create_bd_cell -type ip -vlnv pavel-demin:user:axis_selector:1.0 sel_0
set_property -dict {CONFIG.AXIS_TDATA_WIDTH 16} [get_bd_cells sel_0]
create_bd_cell -type ip -vlnv xilinx.com:ip:xlconstant:1.1 const_0
set_property -dict {CONFIG.CONST_VAL 65535 CONFIG.CONST_WIDTH 16} [get_bd_cells const_0]
create_bd_cell -type ip -vlnv pavel-demin:user:axis_trigger:1.0 trig_0
set_property -dict {CONFIG.AXIS_TDATA_SIGNED TRUE CONFIG.AXIS_TDATA_WIDTH 16} [get_bd_cells trig_0]
create_bd_cell -type ip -vlnv xilinx.com:ip:util_vector_logic:2.0 or_0
set_property -dict {CONFIG.C_OPERATION or CONFIG.C_SIZE 1} [get_bd_cells or_0]
create_bd_cell -type ip -vlnv xilinx.com:ip:axis_combiner:1.1 comb_0
set_property -dict {CONFIG.TDATA_NUM_BYTES 2} [get_bd_cells comb_0]
create_bd_cell -type ip -vlnv pavel-demin:user:axis_oscilloscope:1.0 scope_0
set_property -dict {CONFIG.AXIS_TDATA_WIDTH 32 CONFIG.CNTR_WIDTH 23} [get_bd_cells scope_0]
create_bd_cell -type ip -vlnv xilinx.com:ip:xlconstant:1.1 const_1
set_property -dict {CONFIG.CONST_VAL 262143 CONFIG.CONST_WIDTH 18} [get_bd_cells const_1]
create_bd_cell -type ip -vlnv pavel-demin:user:axis_ram_writer:1.0 writer_0
set_property -dict {CONFIG.ADDR_WIDTH 18 CONFIG.AXIS_TDATA_WIDTH 32 CONFIG.AXI_ID_WIDTH 3} [get_bd_cells writer_0]

# ---- hierarchy /pha_2 ----
current_bd_instance /pha_2
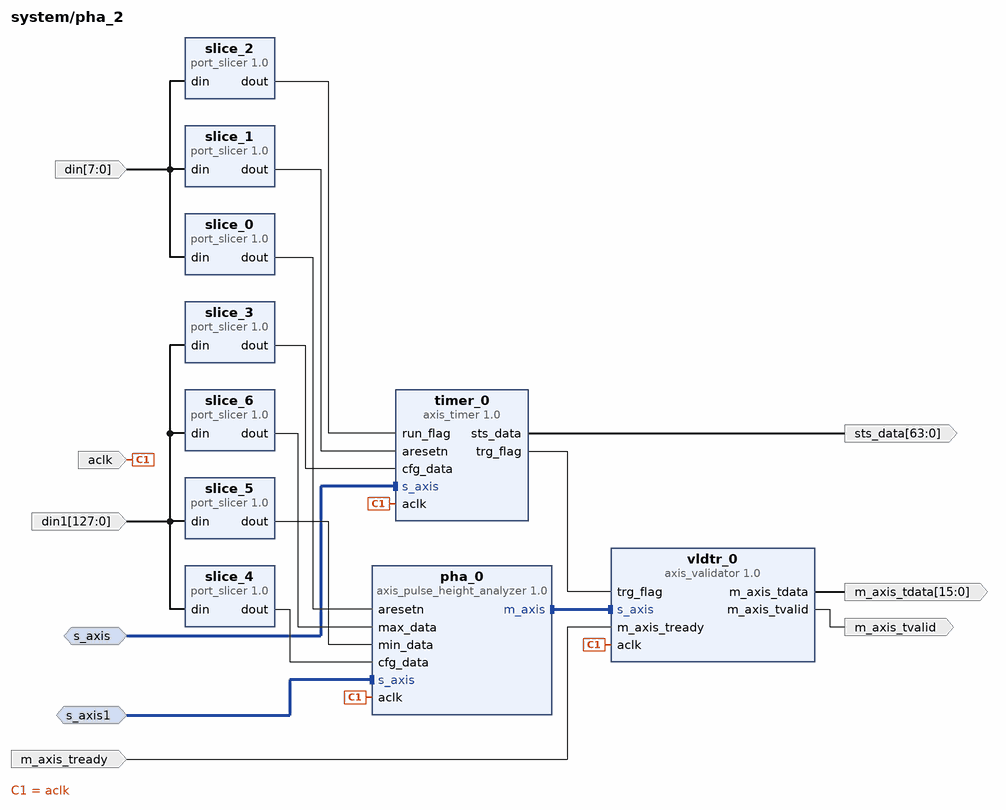
[diagram p8: block diagram inside /pha_2]
create_bd_intf_pin -mode Slave -vlnv xilinx.com:interface:axis_rtl:1.0 s_axis
create_bd_intf_pin -mode Slave -vlnv xilinx.com:interface:axis_rtl:1.0 s_axis1
create_bd_pin -dir I -type clk aclk
create_bd_pin -dir I -from 7 -to 0 din
create_bd_pin -dir I -from 127 -to 0 din1
create_bd_pin -dir I m_axis_tready
create_bd_pin -dir O -from 63 -to 0 sts_data
create_bd_pin -dir O -from 15 -to 0 m_axis_tdata
create_bd_pin -dir O m_axis_tvalid

create_bd_cell -type ip -vlnv pavel-demin:user:port_slicer:1.0 slice_0
set_property -dict {CONFIG.DIN_FROM 0 CONFIG.DIN_TO 0 CONFIG.DIN_WIDTH 8} [get_bd_cells slice_0]
create_bd_cell -type ip -vlnv pavel-demin:user:port_slicer:1.0 slice_1
set_property -dict {CONFIG.DIN_FROM 1 CONFIG.DIN_TO 1 CONFIG.DIN_WIDTH 8} [get_bd_cells slice_1]
create_bd_cell -type ip -vlnv pavel-demin:user:port_slicer:1.0 slice_2
set_property -dict {CONFIG.DIN_FROM 2 CONFIG.DIN_TO 2 CONFIG.DIN_WIDTH 8} [get_bd_cells slice_2]
create_bd_cell -type ip -vlnv pavel-demin:user:port_slicer:1.0 slice_3
set_property -dict {CONFIG.DIN_FROM 63 CONFIG.DIN_TO 0 CONFIG.DIN_WIDTH 128} [get_bd_cells slice_3]
create_bd_cell -type ip -vlnv pavel-demin:user:port_slicer:1.0 slice_4
set_property -dict {CONFIG.DIN_FROM 79 CONFIG.DIN_TO 64 CONFIG.DIN_WIDTH 128} [get_bd_cells slice_4]
create_bd_cell -type ip -vlnv pavel-demin:user:port_slicer:1.0 slice_5
set_property -dict {CONFIG.DIN_FROM 95 CONFIG.DIN_TO 80 CONFIG.DIN_WIDTH 128} [get_bd_cells slice_5]
create_bd_cell -type ip -vlnv pavel-demin:user:port_slicer:1.0 slice_6
set_property -dict {CONFIG.DIN_FROM 111 CONFIG.DIN_TO 96 CONFIG.DIN_WIDTH 128} [get_bd_cells slice_6]
create_bd_cell -type ip -vlnv pavel-demin:user:axis_timer:1.0 timer_0
set_property -dict {CONFIG.CNTR_WIDTH 64} [get_bd_cells timer_0]
create_bd_cell -type ip -vlnv pavel-demin:user:axis_pulse_height_analyzer:1.0 pha_0
set_property -dict {CONFIG.AXIS_TDATA_SIGNED TRUE CONFIG.AXIS_TDATA_WIDTH 16 CONFIG.CNTR_WIDTH 16} [get_bd_cells pha_0]
create_bd_cell -type ip -vlnv pavel-demin:user:axis_validator:1.0 vldtr_0
set_property -dict {CONFIG.AXIS_TDATA_WIDTH 16} [get_bd_cells vldtr_0]

# ---- hierarchy /pha_3 ----
current_bd_instance /pha_3
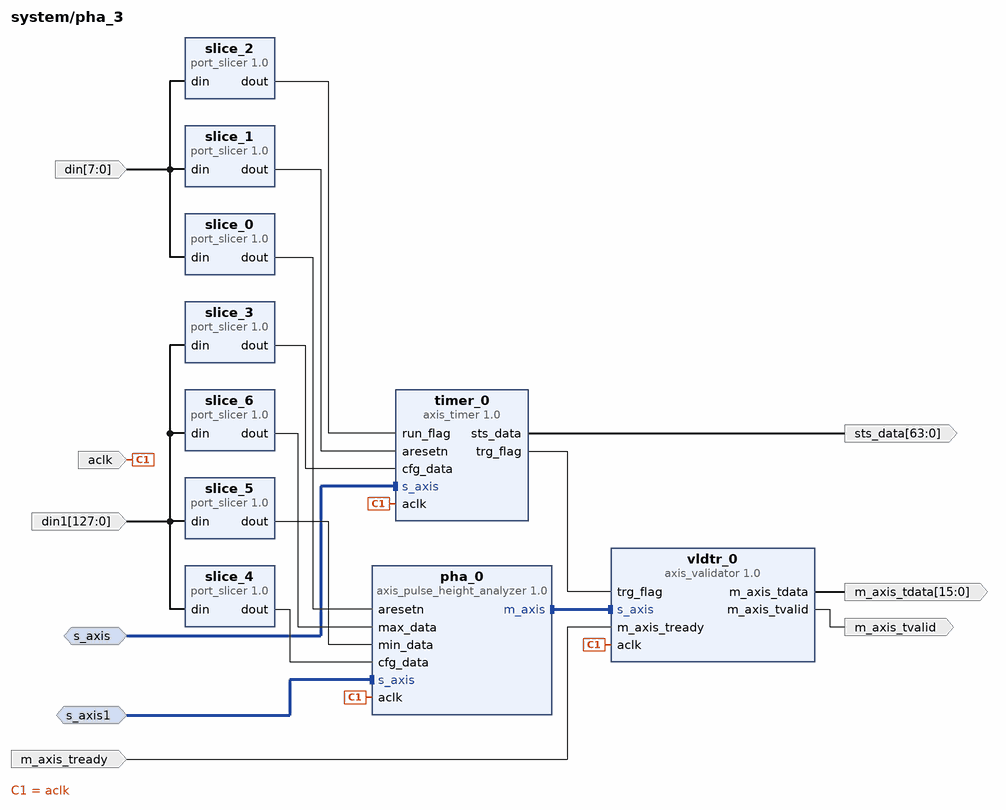
[diagram p9: block diagram inside /pha_3]
create_bd_intf_pin -mode Slave -vlnv xilinx.com:interface:axis_rtl:1.0 s_axis
create_bd_intf_pin -mode Slave -vlnv xilinx.com:interface:axis_rtl:1.0 s_axis1
create_bd_pin -dir I -type clk aclk
create_bd_pin -dir I -from 7 -to 0 din
create_bd_pin -dir I -from 127 -to 0 din1
create_bd_pin -dir I m_axis_tready
create_bd_pin -dir O -from 15 -to 0 m_axis_tdata
create_bd_pin -dir O m_axis_tvalid
create_bd_pin -dir O -from 63 -to 0 sts_data

create_bd_cell -type ip -vlnv pavel-demin:user:port_slicer:1.0 slice_0
set_property -dict {CONFIG.DIN_FROM 0 CONFIG.DIN_TO 0 CONFIG.DIN_WIDTH 8} [get_bd_cells slice_0]
create_bd_cell -type ip -vlnv pavel-demin:user:port_slicer:1.0 slice_1
set_property -dict {CONFIG.DIN_FROM 1 CONFIG.DIN_TO 1 CONFIG.DIN_WIDTH 8} [get_bd_cells slice_1]
create_bd_cell -type ip -vlnv pavel-demin:user:port_slicer:1.0 slice_2
set_property -dict {CONFIG.DIN_FROM 2 CONFIG.DIN_TO 2 CONFIG.DIN_WIDTH 8} [get_bd_cells slice_2]
create_bd_cell -type ip -vlnv pavel-demin:user:port_slicer:1.0 slice_3
set_property -dict {CONFIG.DIN_FROM 63 CONFIG.DIN_TO 0 CONFIG.DIN_WIDTH 128} [get_bd_cells slice_3]
create_bd_cell -type ip -vlnv pavel-demin:user:port_slicer:1.0 slice_4
set_property -dict {CONFIG.DIN_FROM 79 CONFIG.DIN_TO 64 CONFIG.DIN_WIDTH 128} [get_bd_cells slice_4]
create_bd_cell -type ip -vlnv pavel-demin:user:port_slicer:1.0 slice_5
set_property -dict {CONFIG.DIN_FROM 95 CONFIG.DIN_TO 80 CONFIG.DIN_WIDTH 128} [get_bd_cells slice_5]
create_bd_cell -type ip -vlnv pavel-demin:user:port_slicer:1.0 slice_6
set_property -dict {CONFIG.DIN_FROM 111 CONFIG.DIN_TO 96 CONFIG.DIN_WIDTH 128} [get_bd_cells slice_6]
create_bd_cell -type ip -vlnv pavel-demin:user:axis_timer:1.0 timer_0
set_property -dict {CONFIG.CNTR_WIDTH 64} [get_bd_cells timer_0]
create_bd_cell -type ip -vlnv pavel-demin:user:axis_pulse_height_analyzer:1.0 pha_0
set_property -dict {CONFIG.AXIS_TDATA_SIGNED TRUE CONFIG.AXIS_TDATA_WIDTH 16 CONFIG.CNTR_WIDTH 16} [get_bd_cells pha_0]
create_bd_cell -type ip -vlnv pavel-demin:user:axis_validator:1.0 vldtr_0
set_property -dict {CONFIG.AXIS_TDATA_WIDTH 16} [get_bd_cells vldtr_0]

# ---- hierarchy /gen_0 ----
current_bd_instance /gen_0
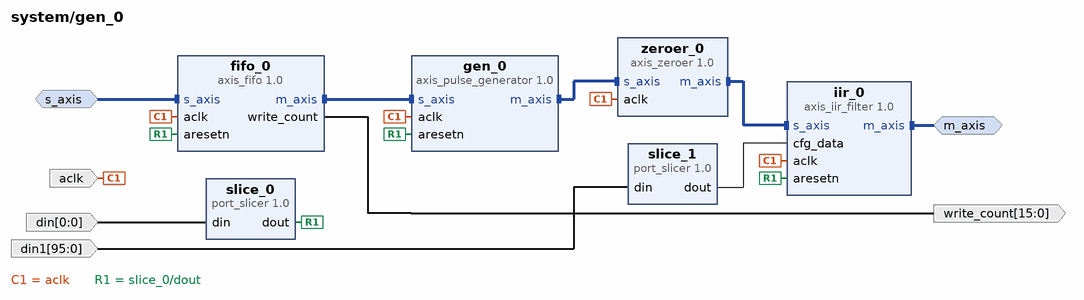
[diagram p10: block diagram inside /gen_0]
create_bd_intf_pin -mode Master -vlnv xilinx.com:interface:axis_rtl:1.0 m_axis
create_bd_intf_pin -mode Slave -vlnv xilinx.com:interface:axis_rtl:1.0 s_axis
create_bd_pin -dir I -type clk aclk
create_bd_pin -dir I -from 0 -to 0 din
create_bd_pin -dir I -from 95 -to 0 din1
create_bd_pin -dir O -from 15 -to 0 write_count

create_bd_cell -type ip -vlnv pavel-demin:user:port_slicer:1.0 slice_0
set_property -dict {CONFIG.DIN_FROM 0 CONFIG.DIN_TO 0 CONFIG.DIN_WIDTH 8} [get_bd_cells slice_0]
create_bd_cell -type ip -vlnv pavel-demin:user:port_slicer:1.0 slice_1
set_property -dict {CONFIG.DIN_FROM 79 CONFIG.DIN_TO 0 CONFIG.DIN_WIDTH 96} [get_bd_cells slice_1]
create_bd_cell -type ip -vlnv pavel-demin:user:axis_fifo:1.0 fifo_0
set_property -dict {CONFIG.M_AXIS_TDATA_WIDTH 64 CONFIG.S_AXIS_TDATA_WIDTH 32 CONFIG.WRITE_DEPTH 16384} [get_bd_cells fifo_0]
create_bd_cell -type ip -vlnv pavel-demin:user:axis_pulse_generator:1.0 gen_0
create_bd_cell -type ip -vlnv pavel-demin:user:axis_zeroer:1.0 zeroer_0
set_property -dict {CONFIG.AXIS_TDATA_WIDTH 16} [get_bd_cells zeroer_0]
create_bd_cell -type ip -vlnv pavel-demin:user:axis_iir_filter:1.0 iir_0

# ---- connections ----

current_bd_instance /pha_0
connect_bd_intf_net [get_bd_intf_pins timer_0/s_axis] [get_bd_intf_pins s_axis]
connect_bd_intf_net [get_bd_intf_pins pha_0/s_axis] [get_bd_intf_pins s_axis1]
connect_bd_intf_net [get_bd_intf_pins vldtr_0/s_axis] [get_bd_intf_pins pha_0/m_axis]
connect_bd_intf_net [get_bd_intf_pins m_axis] [get_bd_intf_pins vldtr_0/m_axis]
connect_bd_net [get_bd_pins aclk] [get_bd_pins timer_0/aclk] [get_bd_pins pha_0/aclk] [get_bd_pins vldtr_0/aclk]
connect_bd_net -net din1_1 [get_bd_pins din1] [get_bd_pins slice_3/din] [get_bd_pins slice_4/din] [get_bd_pins slice_5/din] [get_bd_pins slice_6/din]
connect_bd_net [get_bd_pins din] [get_bd_pins slice_0/din] [get_bd_pins slice_1/din] [get_bd_pins slice_2/din]
connect_bd_net [get_bd_pins slice_0/dout] [get_bd_pins pha_0/aresetn]
connect_bd_net [get_bd_pins slice_1/dout] [get_bd_pins timer_0/aresetn]
connect_bd_net [get_bd_pins slice_2/dout] [get_bd_pins timer_0/run_flag]
connect_bd_net [get_bd_pins slice_3/dout] [get_bd_pins timer_0/cfg_data]
connect_bd_net [get_bd_pins slice_4/dout] [get_bd_pins pha_0/cfg_data]
connect_bd_net [get_bd_pins slice_5/dout] [get_bd_pins pha_0/min_data]
connect_bd_net [get_bd_pins slice_6/dout] [get_bd_pins pha_0/max_data]
connect_bd_net [get_bd_pins timer_0/sts_data] [get_bd_pins sts_data]
connect_bd_net [get_bd_pins timer_0/trg_flag] [get_bd_pins vldtr_0/trg_flag]

current_bd_instance /hst_0
connect_bd_intf_net [get_bd_intf_pins bram_0/BRAM_PORTA] [get_bd_intf_pins BRAM_PORTA]
connect_bd_intf_net [get_bd_intf_pins hst_0/b_bram] [get_bd_intf_pins bram_0/BRAM_PORTB]
connect_bd_intf_net [get_bd_intf_pins s_axis] [get_bd_intf_pins hst_0/s_axis]
connect_bd_net [get_bd_pins aclk] [get_bd_pins hst_0/aclk]
connect_bd_net [get_bd_pins din] [get_bd_pins slice_0/din]
connect_bd_net [get_bd_pins slice_0/dout] [get_bd_pins hst_0/aresetn]

current_bd_instance /pha_1
connect_bd_intf_net [get_bd_intf_pins timer_0/s_axis] [get_bd_intf_pins s_axis]
connect_bd_intf_net [get_bd_intf_pins pha_0/s_axis] [get_bd_intf_pins s_axis1]
connect_bd_intf_net [get_bd_intf_pins vldtr_0/s_axis] [get_bd_intf_pins pha_0/m_axis]
connect_bd_intf_net [get_bd_intf_pins m_axis] [get_bd_intf_pins vldtr_0/m_axis]
connect_bd_net [get_bd_pins aclk] [get_bd_pins timer_0/aclk] [get_bd_pins pha_0/aclk] [get_bd_pins vldtr_0/aclk]
connect_bd_net -net din1_1 [get_bd_pins din1] [get_bd_pins slice_3/din] [get_bd_pins slice_4/din] [get_bd_pins slice_5/din] [get_bd_pins slice_6/din]
connect_bd_net [get_bd_pins din] [get_bd_pins slice_0/din] [get_bd_pins slice_1/din] [get_bd_pins slice_2/din]
connect_bd_net [get_bd_pins slice_0/dout] [get_bd_pins pha_0/aresetn]
connect_bd_net [get_bd_pins slice_1/dout] [get_bd_pins timer_0/aresetn]
connect_bd_net [get_bd_pins slice_2/dout] [get_bd_pins timer_0/run_flag]
connect_bd_net [get_bd_pins slice_3/dout] [get_bd_pins timer_0/cfg_data]
connect_bd_net [get_bd_pins slice_4/dout] [get_bd_pins pha_0/cfg_data]
connect_bd_net [get_bd_pins slice_5/dout] [get_bd_pins pha_0/min_data]
connect_bd_net [get_bd_pins slice_6/dout] [get_bd_pins pha_0/max_data]
connect_bd_net [get_bd_pins timer_0/sts_data] [get_bd_pins sts_data]
connect_bd_net [get_bd_pins timer_0/trg_flag] [get_bd_pins vldtr_0/trg_flag]

current_bd_instance /hst_1
connect_bd_intf_net [get_bd_intf_pins bram_0/BRAM_PORTA] [get_bd_intf_pins BRAM_PORTA]
connect_bd_intf_net [get_bd_intf_pins hst_0/b_bram] [get_bd_intf_pins bram_0/BRAM_PORTB]
connect_bd_intf_net [get_bd_intf_pins s_axis] [get_bd_intf_pins hst_0/s_axis]
connect_bd_net [get_bd_pins aclk] [get_bd_pins hst_0/aclk]
connect_bd_net [get_bd_pins din] [get_bd_pins slice_0/din]
connect_bd_net [get_bd_pins slice_0/dout] [get_bd_pins hst_0/aresetn]

current_bd_instance /osc_0
connect_bd_intf_net [get_bd_intf_pins sel_0/s00_axis] [get_bd_intf_pins s00_axis]
connect_bd_intf_net [get_bd_intf_pins sel_0/s01_axis] [get_bd_intf_pins s01_axis]
connect_bd_intf_net [get_bd_intf_pins comb_0/S00_AXIS] [get_bd_intf_pins S00_AXIS1]
connect_bd_intf_net [get_bd_intf_pins comb_0/S01_AXIS] [get_bd_intf_pins S01_AXIS1]
connect_bd_intf_net [get_bd_intf_pins writer_0/m_axi] [get_bd_intf_pins m_axi]
connect_bd_intf_net [get_bd_intf_pins scope_0/s_axis] [get_bd_intf_pins comb_0/M_AXIS]
connect_bd_intf_net [get_bd_intf_pins writer_0/s_axis] [get_bd_intf_pins scope_0/m_axis]
connect_bd_intf_net [get_bd_intf_pins trig_0/s_axis] [get_bd_intf_pins sel_0/m_axis]
connect_bd_net [get_bd_pins aclk] \
  [get_bd_pins sel_0/aclk] [get_bd_pins trig_0/aclk] [get_bd_pins comb_0/aclk] [get_bd_pins scope_0/aclk] \
  [get_bd_pins writer_0/aclk]
connect_bd_net [get_bd_pins aresetn] [get_bd_pins sel_0/aresetn] [get_bd_pins comb_0/aresetn]
connect_bd_net [get_bd_pins const_0/dout] [get_bd_pins trig_0/msk_data]
connect_bd_net [get_bd_pins const_1/dout] [get_bd_pins writer_0/cfg_data]
connect_bd_net -net din1_1 [get_bd_pins din1] [get_bd_pins slice_6/din] [get_bd_pins slice_7/din] [get_bd_pins slice_8/din] [get_bd_pins slice_9/din]
connect_bd_net [get_bd_pins din] \
  [get_bd_pins slice_0/din] [get_bd_pins slice_1/din] [get_bd_pins slice_2/din] [get_bd_pins slice_3/din] \
  [get_bd_pins slice_4/din] [get_bd_pins slice_5/din]
connect_bd_net [get_bd_pins or_0/Res] [get_bd_pins scope_0/trg_flag]
connect_bd_net [get_bd_pins scope_0/sts_data] [get_bd_pins sts_data]
connect_bd_net [get_bd_pins slice_0/dout] [get_bd_pins scope_0/aresetn]
connect_bd_net [get_bd_pins slice_1/dout] [get_bd_pins writer_0/aresetn]
connect_bd_net [get_bd_pins slice_2/dout] [get_bd_pins sel_0/cfg_data]
connect_bd_net [get_bd_pins slice_3/dout] [get_bd_pins trig_0/pol_data]
connect_bd_net [get_bd_pins slice_4/dout] [get_bd_pins or_0/Op1]
connect_bd_net [get_bd_pins slice_5/dout] [get_bd_pins scope_0/run_flag]
connect_bd_net [get_bd_pins slice_6/dout] [get_bd_pins writer_0/min_addr]
connect_bd_net [get_bd_pins slice_7/dout] [get_bd_pins scope_0/pre_data]
connect_bd_net [get_bd_pins slice_8/dout] [get_bd_pins scope_0/tot_data]
connect_bd_net [get_bd_pins slice_9/dout] [get_bd_pins trig_0/lvl_data]
connect_bd_net [get_bd_pins trig_0/trg_flag] [get_bd_pins or_0/Op2]
connect_bd_net [get_bd_pins writer_0/sts_data] [get_bd_pins sts_data1]

current_bd_instance /pha_2
connect_bd_intf_net [get_bd_intf_pins timer_0/s_axis] [get_bd_intf_pins s_axis]
connect_bd_intf_net [get_bd_intf_pins pha_0/s_axis] [get_bd_intf_pins s_axis1]
connect_bd_intf_net [get_bd_intf_pins vldtr_0/s_axis] [get_bd_intf_pins pha_0/m_axis]
connect_bd_net [get_bd_pins aclk] [get_bd_pins timer_0/aclk] [get_bd_pins pha_0/aclk] [get_bd_pins vldtr_0/aclk]
connect_bd_net -net din1_1 [get_bd_pins din1] [get_bd_pins slice_3/din] [get_bd_pins slice_4/din] [get_bd_pins slice_5/din] [get_bd_pins slice_6/din]
connect_bd_net [get_bd_pins din] [get_bd_pins slice_0/din] [get_bd_pins slice_1/din] [get_bd_pins slice_2/din]
connect_bd_net [get_bd_pins m_axis_tready] [get_bd_pins vldtr_0/m_axis_tready]
connect_bd_net [get_bd_pins slice_0/dout] [get_bd_pins pha_0/aresetn]
connect_bd_net [get_bd_pins slice_1/dout] [get_bd_pins timer_0/aresetn]
connect_bd_net [get_bd_pins slice_2/dout] [get_bd_pins timer_0/run_flag]
connect_bd_net [get_bd_pins slice_3/dout] [get_bd_pins timer_0/cfg_data]
connect_bd_net [get_bd_pins slice_4/dout] [get_bd_pins pha_0/cfg_data]
connect_bd_net [get_bd_pins slice_5/dout] [get_bd_pins pha_0/min_data]
connect_bd_net [get_bd_pins slice_6/dout] [get_bd_pins pha_0/max_data]
connect_bd_net [get_bd_pins timer_0/sts_data] [get_bd_pins sts_data]
connect_bd_net [get_bd_pins timer_0/trg_flag] [get_bd_pins vldtr_0/trg_flag]
connect_bd_net [get_bd_pins vldtr_0/m_axis_tdata] [get_bd_pins m_axis_tdata]
connect_bd_net [get_bd_pins vldtr_0/m_axis_tvalid] [get_bd_pins m_axis_tvalid]

current_bd_instance /pha_3
connect_bd_intf_net [get_bd_intf_pins timer_0/s_axis] [get_bd_intf_pins s_axis]
connect_bd_intf_net [get_bd_intf_pins pha_0/s_axis] [get_bd_intf_pins s_axis1]
connect_bd_intf_net [get_bd_intf_pins vldtr_0/s_axis] [get_bd_intf_pins pha_0/m_axis]
connect_bd_net [get_bd_pins aclk] [get_bd_pins timer_0/aclk] [get_bd_pins pha_0/aclk] [get_bd_pins vldtr_0/aclk]
connect_bd_net -net din1_1 [get_bd_pins din1] [get_bd_pins slice_3/din] [get_bd_pins slice_4/din] [get_bd_pins slice_5/din] [get_bd_pins slice_6/din]
connect_bd_net [get_bd_pins din] [get_bd_pins slice_0/din] [get_bd_pins slice_1/din] [get_bd_pins slice_2/din]
connect_bd_net [get_bd_pins m_axis_tready] [get_bd_pins vldtr_0/m_axis_tready]
connect_bd_net [get_bd_pins slice_0/dout] [get_bd_pins pha_0/aresetn]
connect_bd_net [get_bd_pins slice_1/dout] [get_bd_pins timer_0/aresetn]
connect_bd_net [get_bd_pins slice_2/dout] [get_bd_pins timer_0/run_flag]
connect_bd_net [get_bd_pins slice_3/dout] [get_bd_pins timer_0/cfg_data]
connect_bd_net [get_bd_pins slice_4/dout] [get_bd_pins pha_0/cfg_data]
connect_bd_net [get_bd_pins slice_5/dout] [get_bd_pins pha_0/min_data]
connect_bd_net [get_bd_pins slice_6/dout] [get_bd_pins pha_0/max_data]
connect_bd_net [get_bd_pins timer_0/sts_data] [get_bd_pins sts_data]
connect_bd_net [get_bd_pins timer_0/trg_flag] [get_bd_pins vldtr_0/trg_flag]
connect_bd_net [get_bd_pins vldtr_0/m_axis_tdata] [get_bd_pins m_axis_tdata]
connect_bd_net [get_bd_pins vldtr_0/m_axis_tvalid] [get_bd_pins m_axis_tvalid]
